# EAGLE design untitled (EAGLE 5.06)
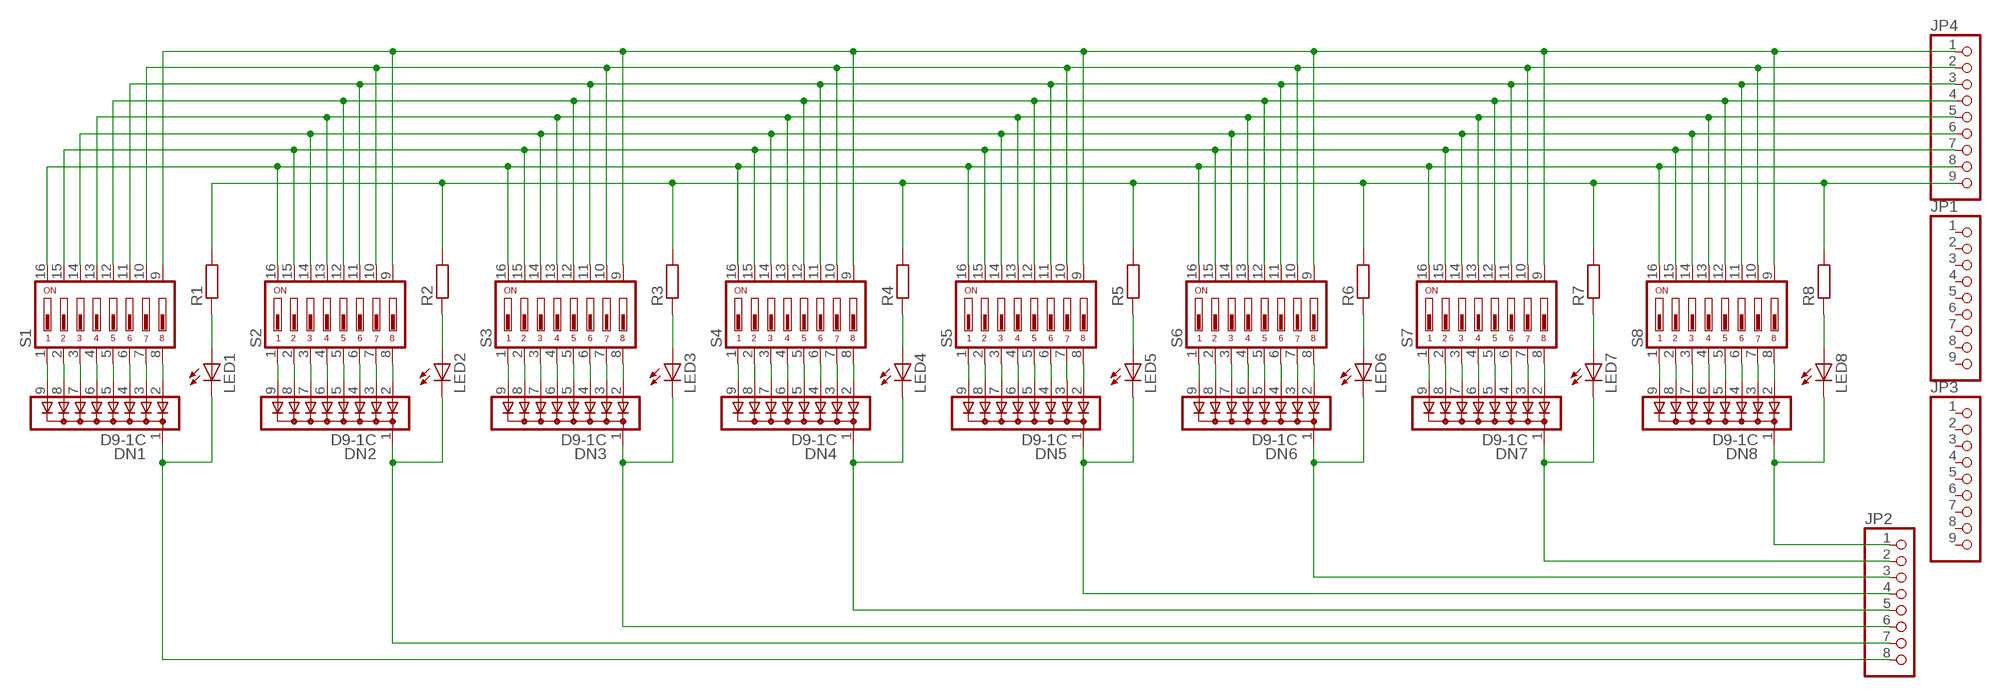
[diagram p0: schematic, sheet 1]

## Parts
DN1  D9-1C  [SIL09C]
DN2  D9-1C  [SIL09C]
DN3  D9-1C  [SIL09C]
DN4  D9-1C  [SIL09C]
DN5  D9-1C  [SIL09C]
DN6  D9-1C  [SIL09C]
DN7  D9-1C  [SIL09C]
DN8  D9-1C  [SIL09C]
JP1  PINHD-1X9  [1X09]
JP2  PINHD-1X8  [1X08]
JP3  PINHD-1X9  [1X09]
JP4  PINHD-1X9  [1X09]
LED1  LED5MM  [LED5MM]
LED2  LED5MM  [LED5MM]
LED3  LED5MM  [LED5MM]
LED4  LED5MM  [LED5MM]
LED5  LED5MM  [LED5MM]
LED6  LED5MM  [LED5MM]
LED7  LED5MM  [LED5MM]
LED8  LED5MM  [LED5MM]
R1  R-EU_0207/10  [0207/10]
R2  R-EU_0207/10  [0207/10]
R3  R-EU_0207/10  [0207/10]
R4  R-EU_0207/10  [0207/10]
R5  R-EU_0207/10  [0207/10]
R6  R-EU_0207/10  [0207/10]
R7  R-EU_0207/10  [0207/10]
R8  R-EU_0207/10  [0207/10]
S1  DIP08YL  [DIP08YL]
S2  DIP08YL  [DIP08YL]
S3  DIP08YL  [DIP08YL]
S4  DIP08YL  [DIP08YL]
S5  DIP08YL  [DIP08YL]
S6  DIP08YL  [DIP08YL]
S7  DIP08YL  [DIP08YL]
S8  DIP08YL  [DIP08YL]

## Nets
N$1: JP4.1 S1.9 S2.9 S3.9 S4.9 S5.9 S6.9 S7.9 S8.9
N$2: JP4.2 S1.10 S2.10 S3.10 S4.10 S5.10 S6.10 S7.10 S8.10
N$3: JP4.3 S1.11 S2.11 S3.11 S4.11 S5.11 S6.11 S7.11 S8.11
N$4: JP4.4 S1.12 S2.12 S3.12 S4.12 S5.12 S6.12 S7.12 S8.12
N$5: JP4.5 S1.13 S2.13 S3.13 S4.13 S5.13 S6.13 S7.13 S8.13
N$6: JP4.6 S1.14 S2.14 S3.14 S4.14 S5.14 S6.14 S7.14 S8.14
N$7: JP4.7 S1.15 S2.15 S3.15 S4.15 S5.15 S6.15 S7.15 S8.15
N$8: JP4.8 S1.16 S2.16 S3.16 S4.16 S5.16 S6.16 S7.16 S8.16
N$9: DN7.6 S7.4
N$10: DN8.1(C) JP2.1 LED8.K(C)
N$11: DN7.1(C) JP2.2 LED7.K(C)
N$12: DN6.1(C) JP2.3 LED6.K(C)
N$13: DN5.1(C) JP2.4 LED5.K(C)
N$14: DN4.1(C) JP2.5 LED4.K(C)
N$15: DN3.1(C) JP2.6 LED3.K(C)
N$16: DN2.1(C) JP2.7 LED2.K(C)
N$17: DN1.1(C) JP2.8 LED1.K(C)
N$18: LED1.A R1.1
N$19: DN7.8 S7.2
N$20: LED2.A R2.1
N$21: DN7.9 S7.1
N$22: LED3.A R3.1
N$23: DN6.2 S6.8
N$24: LED4.A R4.1
N$25: DN6.3 S6.7
N$26: LED5.A R5.1
N$27: DN6.4 S6.6
N$28: LED6.A R6.1
N$29: DN6.5 S6.5
N$30: LED7.A R7.1
N$31: JP4.9 R1.2 R2.2 R3.2 R4.2 R5.2 R6.2 R7.2 R8.2
N$32: LED8.A R8.1
N$33: DN8.2 S8.8
N$34: DN8.3 S8.7
N$35: DN8.4 S8.6
N$36: DN8.5 S8.5
N$37: DN8.6 S8.4
N$38: DN8.7 S8.3
N$39: DN8.8 S8.2
N$40: DN8.9 S8.1
N$41: DN7.2 S7.8
N$42: DN7.3 S7.7
N$43: DN7.4 S7.6
N$44: DN7.5 S7.5
N$45: DN6.6 S6.4
N$46: DN7.7 S7.3
N$47: DN6.7 S6.3
N$48: DN6.8 S6.2
N$49: DN6.9 S6.1
N$50: DN5.2 S5.8
N$51: DN5.3 S5.7
N$52: DN5.4 S5.6
N$53: DN5.5 S5.5
N$54: DN5.6 S5.4
N$55: DN5.7 S5.3
N$56: DN5.8 S5.2
N$57: DN5.9 S5.1
N$58: DN4.2 S4.8
N$59: DN4.3 S4.7
N$60: DN4.4 S4.6
N$61: DN4.5 S4.5
N$62: DN4.6 S4.4
N$63: DN4.7 S4.3
N$64: DN4.8 S4.2
N$65: DN4.9 S4.1
N$66: DN3.2 S3.8
N$67: DN3.3 S3.7
N$68: DN3.4 S3.6
N$69: DN3.5 S3.5
N$70: DN3.6 S3.4
N$71: DN3.7 S3.3
N$72: DN3.8 S3.2
N$73: DN3.9 S3.1
N$74: DN2.2 S2.8
N$75: DN2.3 S2.7
N$76: DN2.4 S2.6
N$77: DN2.5 S2.5
N$78: DN2.6 S2.4
N$79: DN2.7 S2.3
N$80: DN2.8 S2.2
N$81: DN2.9 S2.1
N$82: DN1.2 S1.8
N$83: DN1.3 S1.7
N$84: DN1.4 S1.6
N$85: DN1.5 S1.5
N$86: DN1.6 S1.4
N$87: DN1.7 S1.3
N$88: DN1.8 S1.2
N$89: DN1.9 S1.1
Unconnected: JP1.1 JP1.2 JP1.3 JP1.4 JP1.5 JP1.6 JP1.7 JP1.8 JP1.9 JP3.1 JP3.2 JP3.3 JP3.4 JP3.5 JP3.6 JP3.7 JP3.8 JP3.9

## Library data of the parts
DN1-DN8 = diode:D9-1C: 8 DIODES SIL, common cathode
JP1 JP3 JP4 = pinhead:PINHD-1X9: PIN HEADER
JP2 = pinhead:PINHD-1X8: PIN HEADER
LED1-LED8 = led:LED: LED OSRAM: - CHIPLED LG R971, LG N971, LY N971, LG Q971, LY Q971, LO R971, LY R971 LH N974, LH R974 LS Q976, LO Q976, LY Q976 LO Q996 - Hyper CHIPLED LW Q18S LB Q993, LB Q99A, LB R99A - SideLED LS A670, LO A670, LY A670, LG A670, LP A670 LB A673, LV A673, LT A673, LW A673 LH A674 LY A675 LS A676, LA A676, LO A676, LY A676, LW A676 LS A679, LY A679, LG A679 - Hyper Micro SIDELED® LS Y876, LA Y876, LO Y876, LY Y876 LT Y87S - SmartLED LW L88C, LW L88S LB L89C, LB L89S, LG L890 LS L89K, LO L89K, LY L89K LS L896, LA L896, LO L896, LY L896 - TOPLED LS T670, LO T670, LY T670, LG T670, LP T670 LSG T670, LSP T670, LSY T670, LOP T670, LYG T670 LG T671, LOG T671, LSG T671 LB T673, LV T673, LT T673, LW T673 LH T674 LS T676, LA T676, LO T676, LY T676, LB T676, LH T676, LSB T676, LW T676 LB T67C, LV T67C, LT T67C, LS T67K, LO T67K, LY T67K, LW E67C LS E67B, LA E67B, LO E67B, LY E67B, LB E67C, LV E67C, LT E67C LW T67C LS T679, LY T679, LG T679 LS T770, LO T770, LY T770, LG T770, LP T770 LB T773, LV T773, LT T773, LW T773 LH T774 LS E675, LA E675, LY E675, LS T675 LS T776, LA T776, LO T776, LY T776, LB T776 LHGB T686 LT T68C, LB T68C - Hyper Mini TOPLED® LB M676 - Mini TOPLED Santana® LG M470 LS M47K, LO M47K, LY M47K Source: http://www.osram.convergy.de LUXEON: - LUMILED® LXK2-PW12-R00, LXK2-PW12-S00, LXK2-PW14-U00, LXK2-PW14-V00 LXK2-PM12-R00, LXK2-PM12-S00, LXK2-PM14-U00 LXK2-PE12-Q00, LXK2-PE12-R00, LXK2-PE12-S00, LXK2-PE14-T00, LXK2-PE14-U00 LXK2-PB12-K00, LXK2-PB12-L00, LXK2-PB12-M00, LXK2-PB14-N00, LXK2-PB14-P00, LXK2-PB14-Q00 LXK2-PR12-L00, LXK2-PR12-M00, LXK2-PR14-Q00, LXK2-PR14-R00 LXK2-PD12-Q00, LXK2-PD12-R00, LXK2-PD12-S00 LXK2-PH12-R00, LXK2-PH12-S00 LXK2-PL12-P00, LXK2-PL12-Q00, LXK2-PL12-R00 Source: www.luxeon.com KINGBRIGHT: KA-3528ASYC Source: www.kingbright.com
R1-R8 = resistor:R-EU_: RESISTOR, European symbol
S1-S8 = switch-dil:DIP08YL: DIL/CODE SWITCH

## Board
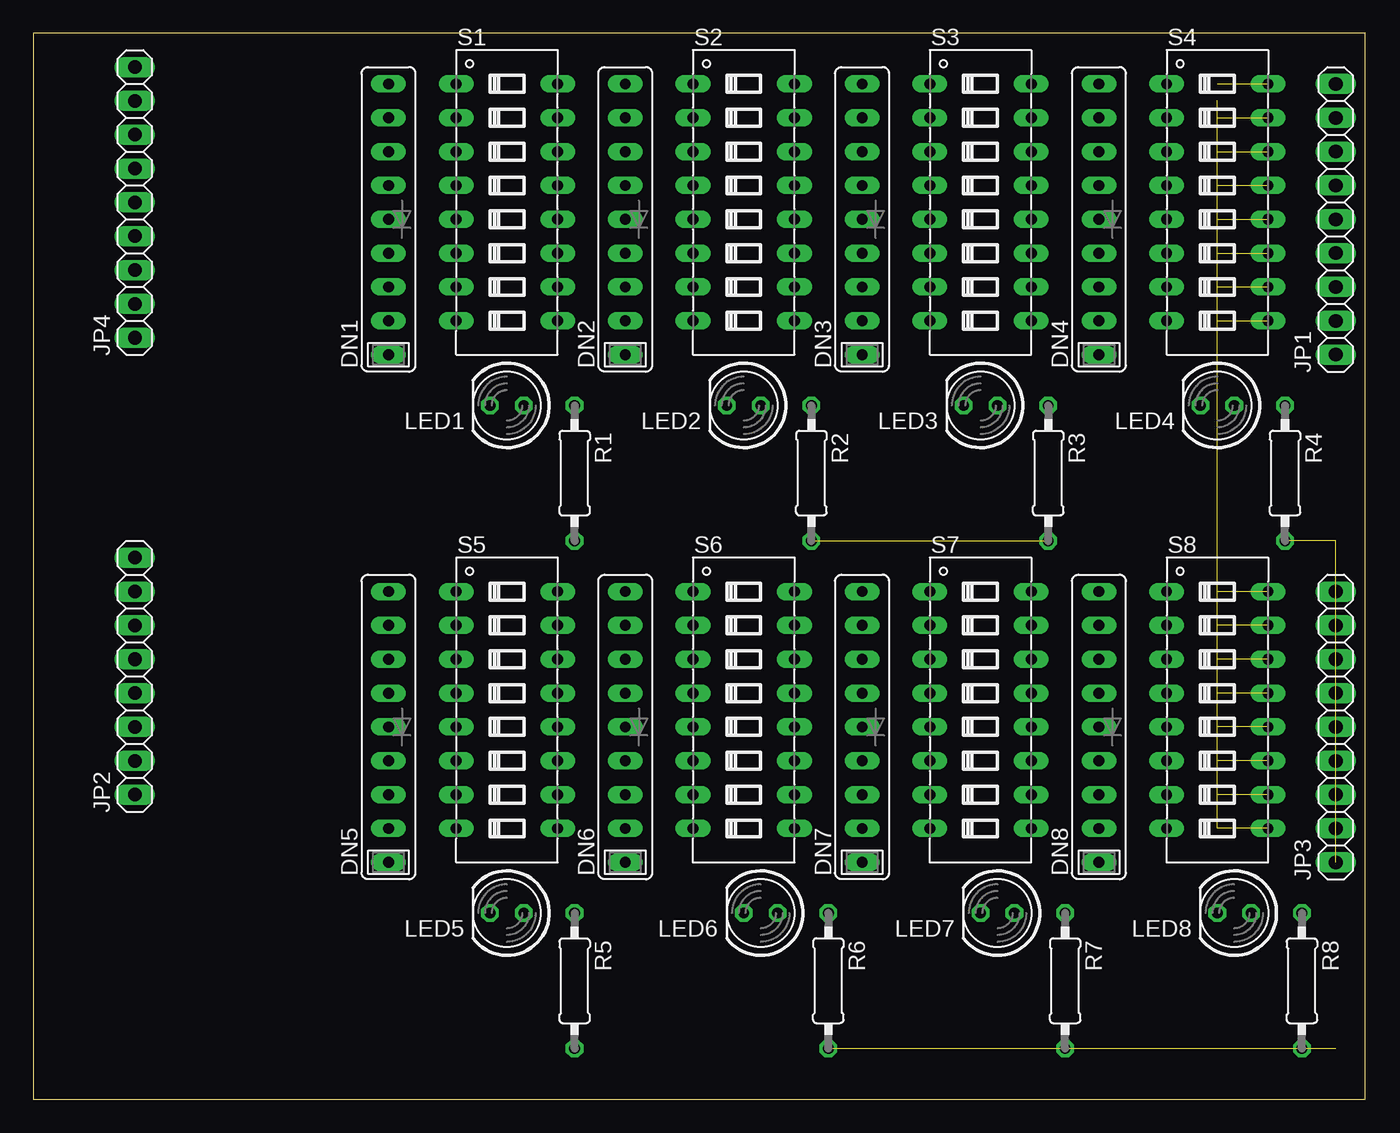
[diagram p1: board, top side]
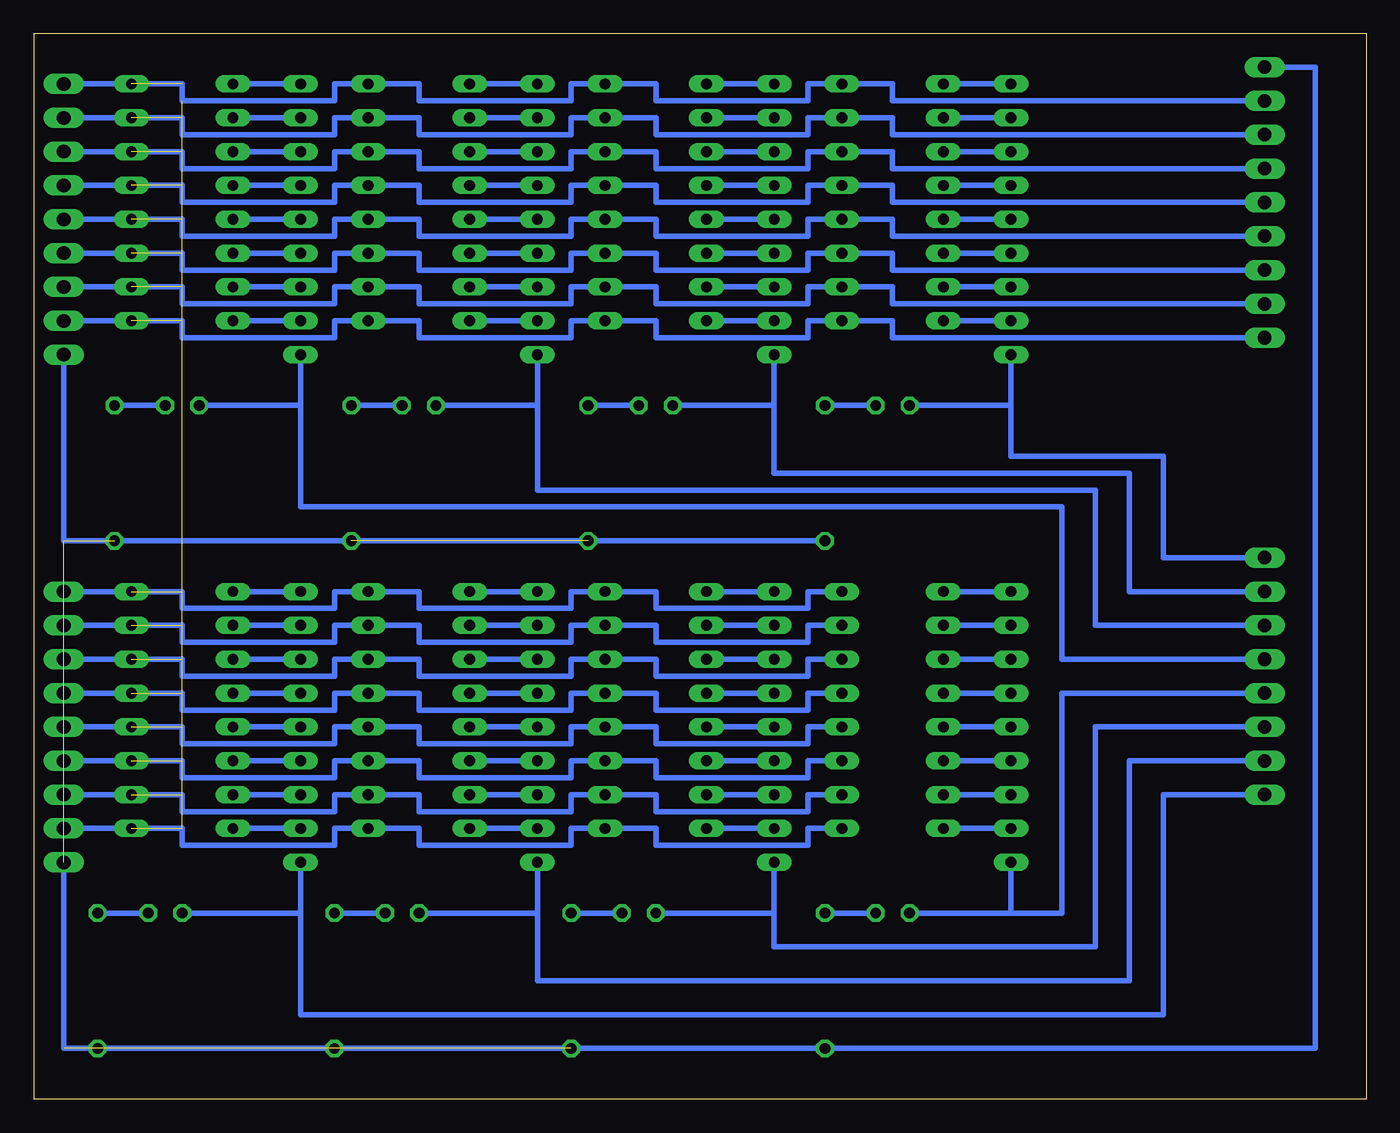
[diagram p2: board, bottom side, seen from below]

Size 100 x 80 mm. Coordinates in mm from the lower left corner, seen from the top.
Outline: 0,0 100,0 100,80 0,80 0,0
Copper layers (1*16): Top 0.035mm / dielectric 1.5mm / Bottom 0.035mm
Design rules "default": minimum track width 10mil, minimum drill 24mil, track to track 8mil, track to pad 8mil, pad to pad 8mil, via to via 8mil, smd to smd 8mil, copper to edge 40mil, drill to drill 8mil, minimum pad ring 10mil, minimum via ring 8mil, stop-mask expansion 4mil, vias tented up to drill 0mil, thermal gap 10mil

### Footprints (pad centres in the part's own frame; a part is rotated, then mirrored left to right if it is on the bottom)
SIL09C = drill 0.813 long: 1 -10.16,0; 2 -7.62,0; 3 -5.08,0; 4 -2.54,0; 5 0,0; 6 2.54,0; 7 5.08,0; 8 7.62,0; 9 10.16,0
1X09 = drill 1.016 long: 1 -10.16,0; 2 -7.62,0; 3 -5.08,0; 4 -2.54,0; 5 0,0; 6 2.54,0; 7 5.08,0; 8 7.62,0; 9 10.16,0
1X08 = drill 1.016 long: 1 -8.89,0; 2 -6.35,0; 3 -3.81,0; 4 -1.27,0; 5 1.27,0; 6 3.81,0; 7 6.35,0; 8 8.89,0
LED5MM = drill 0.813 octagon: A -1.27,0; K 1.27,0
0207/10 = drill 0.813 octagon: 1 -5.08,0; 2 5.08,0
DIP08YL = drill 0.813 long: 1 -8.89,-3.81; 2 -6.35,-3.81; 3 -3.81,-3.81; 4 -1.27,-3.81; 5 1.27,-3.81; 6 3.81,-3.81; 7 6.35,-3.81; 8 8.89,-3.81; 9 8.89,3.81; 10 6.35,3.81; 11 3.81,3.81; 12 1.27,3.81; 13 -1.27,3.81; 14 -3.81,3.81; 15 -6.35,3.81; 16 -8.89,3.81

### Placement (x,y rotation side)
DN1  26.67,66.04 90 top
DN2  44.45,66.04 90 top
DN3  62.23,66.04 90 top
DN4  80.01,66.04 90 top
DN5  26.67,27.94 90 top
DN6  44.45,27.94 90 top
DN7  62.23,27.94 90 top
DN8  80.01,27.94 90 top
JP1  97.79,66.04 90 top
JP2  7.62,31.75 90 top
JP3  97.79,27.94 90 top
JP4  7.62,67.31 90 top
LED1  35.56,52.07 180 top
LED2  53.34,52.07 180 top
LED3  71.12,52.07 180 top
LED4  88.9,52.07 180 top
LED5  35.56,13.97 180 top
LED6  54.61,13.97 180 top
LED7  72.39,13.97 180 top
LED8  90.17,13.97 180 top
R1  40.64,46.99 270 top
R2  58.42,46.99 270 top
R3  76.2,46.99 270 top
R4  93.98,46.99 270 top
R5  40.64,8.89 270 top
R6  59.69,8.89 270 top
R7  77.47,8.89 270 top
R8  95.25,8.89 270 top
S1  35.56,67.31 270 top
S2  53.34,67.31 270 top
S3  71.12,67.31 270 top
S4  88.9,67.31 270 top
S5  35.56,29.21 270 top
S6  53.34,29.21 270 top
S7  71.12,29.21 270 top
S8  88.9,29.21 270 top

### Tracks (layer width: path | path; a pad name or v marks a point on that pad's centre or on a via)
N$1  (3 unrouted)
  Bottom 0.406: JP4.1 35.56,57.15 35.56,58.42 S1.9 41.91,58.42 41.91,57.15 53.34,57.15 53.34,58.42 S2.9 59.69,58.42 59.69,57.15 71.12,57.15 71.12,58.42 S3.9 77.47,58.42 77.47,57.15 88.9,57.15 88.9,58.42 97.79,58.42 | S5.9 41.91,20.32 41.91,19.05 53.34,19.05 53.34,20.32 S6.9 59.69,20.32 59.69,19.05 71.12,19.05 71.12,20.32 S7.9 77.47,20.32 77.47,19.05 88.9,19.05 88.9,20.32 97.79,20.32
N$2  (3 unrouted)
  Bottom 0.406: JP4.2 35.56,59.69 35.56,60.96 S1.10 41.91,60.96 41.91,59.69 53.34,59.69 53.34,60.96 S2.10 59.69,60.96 59.69,59.69 71.12,59.69 71.12,60.96 S3.10 77.47,60.96 77.47,59.69 88.9,59.69 88.9,60.96 97.79,60.96 | S5.10 41.91,22.86 41.91,21.59 53.34,21.59 53.34,22.86 S6.10 59.69,22.86 59.69,21.59 71.12,21.59 71.12,22.86 S7.10 77.47,22.86 77.47,21.59 88.9,21.59 88.9,22.86 97.79,22.86
N$3  (3 unrouted)
  Bottom 0.406: JP4.3 35.56,62.23 35.56,63.5 S1.11 41.91,63.5 41.91,62.23 53.34,62.23 53.34,63.5 S2.11 59.69,63.5 59.69,62.23 71.12,62.23 71.12,63.5 S3.11 77.47,63.5 77.47,62.23 88.9,62.23 88.9,63.5 97.79,63.5 | S5.11 41.91,25.4 41.91,24.13 53.34,24.13 53.34,25.4 S6.11 59.69,25.4 59.69,24.13 71.12,24.13 71.12,25.4 S7.11 77.47,25.4 77.47,24.13 88.9,24.13 88.9,25.4 97.79,25.4
N$4  (3 unrouted)
  Bottom 0.406: JP4.4 35.56,64.77 35.56,66.04 S1.12 41.91,66.04 41.91,64.77 53.34,64.77 53.34,66.04 S2.12 59.69,66.04 59.69,64.77 71.12,64.77 71.12,66.04 S3.12 77.47,66.04 77.47,64.77 88.9,64.77 88.9,66.04 97.79,66.04 | S5.12 41.91,27.94 41.91,26.67 53.34,26.67 53.34,27.94 S6.12 59.69,27.94 59.69,26.67 71.12,26.67 71.12,27.94 S7.12 77.47,27.94 77.47,26.67 88.9,26.67 88.9,27.94 97.79,27.94
N$5  (3 unrouted)
  Bottom 0.406: JP4.5 35.56,67.31 35.56,68.58 S1.13 41.91,68.58 41.91,67.31 53.34,67.31 53.34,68.58 S2.13 59.69,68.58 59.69,67.31 71.12,67.31 71.12,68.58 S3.13 77.47,68.58 77.47,67.31 88.9,67.31 88.9,68.58 97.79,68.58 | S5.13 41.91,30.48 41.91,29.21 53.34,29.21 53.34,30.48 S6.13 59.69,30.48 59.69,29.21 71.12,29.21 71.12,30.48 S7.13 77.47,30.48 77.47,29.21 88.9,29.21 88.9,30.48 97.79,30.48
N$6  (3 unrouted)
  Bottom 0.406: JP4.6 35.56,69.85 35.56,71.12 S1.14 41.91,71.12 41.91,69.85 53.34,69.85 53.34,71.12 S2.14 59.69,71.12 59.69,69.85 71.12,69.85 71.12,71.12 S3.14 77.47,71.12 77.47,69.85 88.9,69.85 88.9,71.12 97.79,71.12 | S5.14 41.91,33.02 41.91,31.75 53.34,31.75 53.34,33.02 S6.14 59.69,33.02 59.69,31.75 71.12,31.75 71.12,33.02 S7.14 77.47,33.02 77.47,31.75 88.9,31.75 88.9,33.02 97.79,33.02
N$7  (3 unrouted)
  Bottom 0.406: JP4.7 35.56,72.39 35.56,73.66 S1.15 41.91,73.66 41.91,72.39 53.34,72.39 53.34,73.66 S2.15 59.69,73.66 59.69,72.39 71.12,72.39 71.12,73.66 S3.15 77.47,73.66 77.47,72.39 88.9,72.39 88.9,73.66 97.79,73.66 | S5.15 41.91,35.56 41.91,34.29 53.34,34.29 53.34,35.56 S6.15 59.69,35.56 59.69,34.29 71.12,34.29 71.12,35.56 S7.15 77.47,35.56 77.47,34.29 88.9,34.29 88.9,35.56 97.79,35.56
N$8  (3 unrouted)
  Bottom 0.406: JP4.8 35.56,74.93 35.56,76.2 S1.16 41.91,76.2 41.91,74.93 53.34,74.93 53.34,76.2 S2.16 59.69,76.2 59.69,74.93 71.12,74.93 71.12,76.2 S3.16 77.47,76.2 77.47,74.93 88.9,74.93 88.9,76.2 97.79,76.2 | S5.16 41.91,38.1 41.91,36.83 53.34,36.83 53.34,38.1 S6.16 59.69,38.1 59.69,36.83 71.12,36.83 71.12,38.1 S7.16 77.47,38.1 77.47,36.83 88.9,36.83 88.9,38.1 97.79,38.1
N$9
  Bottom 0.406: DN7.6 S7.4
N$10
  Bottom 0.406: 80.01,13.97 LED8.K | 80.01,13.97 DN8.1 | JP2.1 15.24,22.86 15.24,6.35 80.01,6.35 80.01,13.97
N$11
  Bottom 0.406: 62.23,13.97 LED7.K | 62.23,13.97 DN7.1 | JP2.2 17.78,25.4 17.78,8.89 62.23,8.89 62.23,13.97
N$12
  Bottom 0.406: 44.45,13.97 LED6.K | 44.45,13.97 DN6.1 | JP2.3 20.32,27.94 20.32,11.43 44.45,11.43 44.45,13.97
N$13
  Bottom 0.406: 26.67,13.97 LED5.K | 26.67,13.97 DN5.1 | JP2.4 22.86,30.48 22.86,13.97 26.67,13.97
N$14
  Bottom 0.406: 80.01,52.07 LED4.K | 80.01,52.07 DN4.1 | 80.01,52.07 80.01,44.45 22.86,44.45 22.86,33.02 JP2.5
N$15
  Bottom 0.406: 62.23,52.07 LED3.K | 62.23,52.07 DN3.1 | JP2.6 20.32,35.56 20.32,45.72 62.23,45.72 62.23,52.07
N$16
  Bottom 0.406: 44.45,52.07 LED2.K | 44.45,52.07 DN2.1 | 44.45,52.07 44.45,46.99 17.78,46.99 17.78,38.1 JP2.7
N$17
  Bottom 0.406: 26.67,52.07 LED1.K | 26.67,52.07 DN1.1 | JP2.8 15.24,40.64 15.24,48.26 26.67,48.26 26.67,52.07
N$18
  Bottom 0.406: LED1.A R1.1
N$19
  Bottom 0.406: DN7.8 S7.2
N$20
  Bottom 0.406: LED2.A R2.1
N$21
  Bottom 0.406: DN7.9 S7.1
N$22
  Bottom 0.406: LED3.A R3.1
N$23
  Bottom 0.406: DN6.2 S6.8
N$24
  Bottom 0.406: LED4.A R4.1
N$25
  Bottom 0.406: DN6.3 S6.7
N$26
  Bottom 0.406: LED5.A R5.1
N$27
  Bottom 0.406: DN6.4 S6.6
N$28
  Bottom 0.406: LED6.A R6.1
N$29
  Bottom 0.406: DN6.5 S6.5
N$30
  Bottom 0.406: LED7.A R7.1
N$31  (6 unrouted)
  Bottom 0.406: R1.2 R3.2 97.79,41.91 97.79,55.88 | 97.79,17.78 97.79,3.81 R5.2 3.81,3.81 3.81,77.47 JP4.9
N$32
  Bottom 0.406: LED8.A R8.1
N$33
  Bottom 0.406: DN8.2 S8.8
N$34
  Bottom 0.406: DN8.3 S8.7
N$35
  Bottom 0.406: DN8.4 S8.6
N$36
  Bottom 0.406: DN8.5 S8.5
N$37
  Bottom 0.406: DN8.6 S8.4
N$38
  Bottom 0.406: DN8.7 S8.3
N$39
  Bottom 0.406: DN8.8 S8.2
N$40
  Bottom 0.406: DN8.9 S8.1
N$41
  Bottom 0.406: DN7.2 S7.8
N$42
  Bottom 0.406: DN7.3 S7.7
N$43
  Bottom 0.406: DN7.4 S7.6
N$44
  Bottom 0.406: DN7.5 S7.5
N$45
  Bottom 0.406: DN6.6 S6.4
N$46
  Bottom 0.406: DN7.7 S7.3
N$47
  Bottom 0.406: DN6.7 S6.3
N$48
  Bottom 0.406: DN6.8 S6.2
N$49
  Bottom 0.406: DN6.9 S6.1
N$50
  Bottom 0.406: DN5.2 S5.8
N$51
  Bottom 0.406: DN5.3 S5.7
N$52
  Bottom 0.406: DN5.4 S5.6
N$53
  Bottom 0.406: DN5.5 S5.5
N$54
  Bottom 0.406: DN5.6 S5.4
N$55
  Bottom 0.406: DN5.7 S5.3
N$56
  Bottom 0.406: DN5.8 S5.2
N$57
  Bottom 0.406: DN5.9 S5.1
N$58
  Bottom 0.406: DN4.2 S4.8
N$59
  Bottom 0.406: DN4.3 S4.7
N$60
  Bottom 0.406: DN4.4 S4.6
N$61
  Bottom 0.406: DN4.5 S4.5
N$62
  Bottom 0.406: DN4.6 S4.4
N$63
  Bottom 0.406: DN4.7 S4.3
N$64
  Bottom 0.406: DN4.8 S4.2
N$65
  Bottom 0.406: DN4.9 S4.1
N$66
  Bottom 0.406: DN3.2 S3.8
N$67
  Bottom 0.406: DN3.3 S3.7
N$68
  Bottom 0.406: DN3.4 S3.6
N$69
  Bottom 0.406: DN3.5 S3.5
N$70
  Bottom 0.406: DN3.6 S3.4
N$71
  Bottom 0.406: DN3.7 S3.3
N$72
  Bottom 0.406: DN3.8 S3.2
N$73
  Bottom 0.406: DN3.9 S3.1
N$74
  Bottom 0.406: DN2.2 S2.8
N$75
  Bottom 0.406: DN2.3 S2.7
N$76
  Bottom 0.406: DN2.4 S2.6
N$77
  Bottom 0.406: DN2.5 S2.5
N$78
  Bottom 0.406: DN2.6 S2.4
N$79
  Bottom 0.406: DN2.7 S2.3
N$80
  Bottom 0.406: DN2.8 S2.2
N$81
  Bottom 0.406: DN2.9 S2.1
N$82
  Bottom 0.406: DN1.2 S1.8
N$83
  Bottom 0.406: DN1.3 S1.7
N$84
  Bottom 0.406: DN1.4 S1.6
N$85
  Bottom 0.406: DN1.5 S1.5
N$86
  Bottom 0.406: DN1.6 S1.4
N$87
  Bottom 0.406: DN1.7 S1.3
N$88
  Bottom 0.406: DN1.8 S1.2
N$89
  Bottom 0.406: DN1.9 S1.1